# EAGLE design coderbot_v5.0.rev.2 (EAGLE 9.5.2)
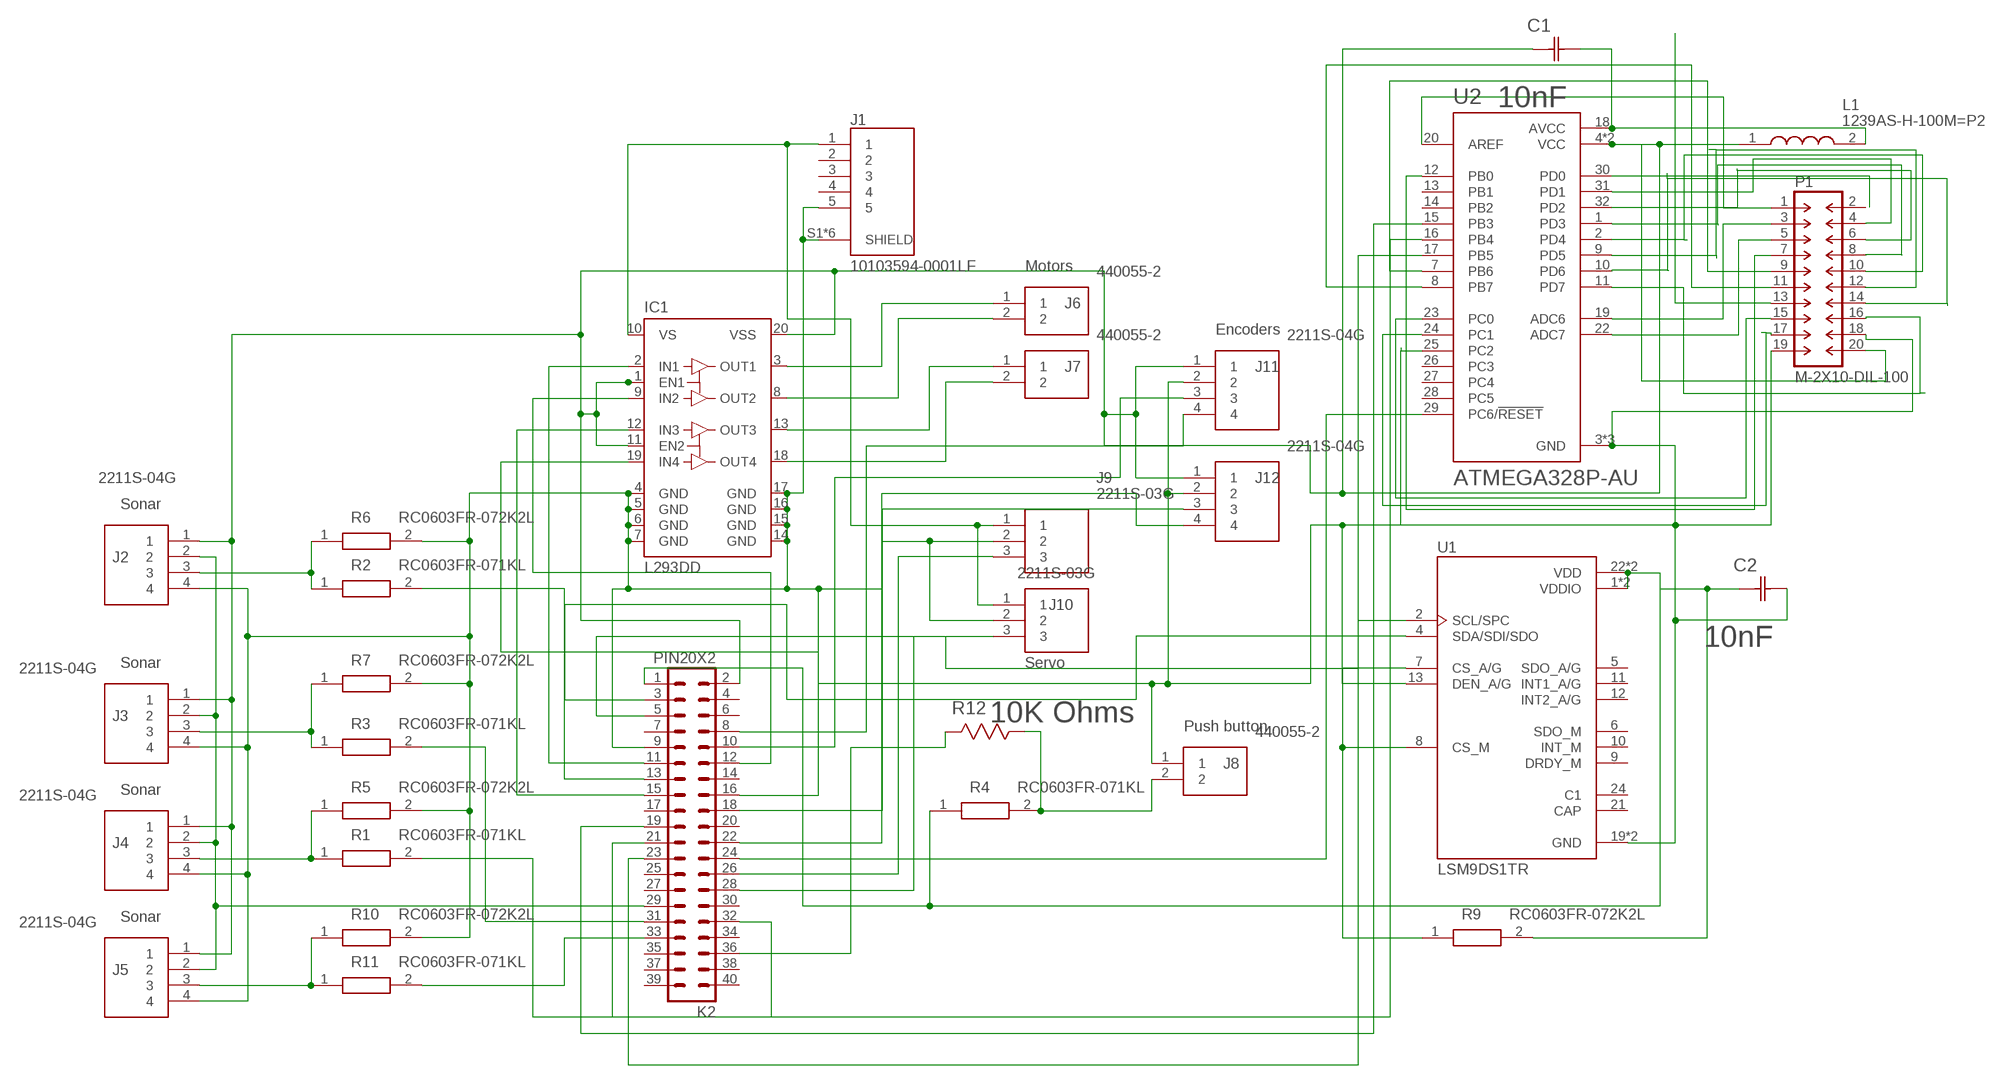
[diagram p0: schematic, sheet 1]

## Parts
C1  10nF  CC0402KRX7R7BB103  [CAPC1005X55N]
C2  10nF  CC0402KRX7R7BB103  [CAPC1005X55N]
IC1  L293DD  [SO20]
J1  10103594-0001LF  [FCI_10103594-0001LF]
J2  2211S-04G  [HDRV4W90P0X254_1X4_1016X254X87]
J3  2211S-04G  [HDRV4W90P0X254_1X4_1016X254X87]
J4  2211S-04G  [HDRV4W90P0X254_1X4_1016X254X87]
J5  2211S-04G  [HDRV4W90P0X254_1X4_1016X254X87]
J6  440055-2  [SHDR2W70P0X200_1X2_600X770X525]
J7  440055-2  [SHDR2W70P0X200_1X2_600X770X525]
J8  440055-2  [SHDR2W70P0X200_1X2_600X770X525]
J9  2211S-03G  [HDRV3W90P0X254_1X3_762X254X874]
J10  2211S-03G  [HDRV3W90P0X254_1X3_762X254X874]
J11  2211S-04G  [HDRV4W90P0X254_1X4_1016X254X87]
J12  2211S-04G  [HDRV4W90P0X254_1X4_1016X254X87]
K2  PIN20X2  [PIN_20X2]
L1  1239AS-H-100M=P2  [INDC2520X120N]
P1  M-2X10-DIL-100  [DIL-100-2X10]
R1  RC0603FR-071KL  [RESC1608X55N]
R2  RC0603FR-071KL  [RESC1608X55N]
R3  RC0603FR-071KL  [RESC1608X55N]
R4  RC0603FR-071KL  [RESC1608X55N]
R5  RC0603FR-072K2L  [RESC1608X55N]
R6  RC0603FR-072K2L  [RESC1608X55N]
R7  RC0603FR-072K2L  [RESC1608X55N]
R9  RC0603FR-072K2L  [RESC1608X55N]
R10  RC0603FR-072K2L  [RESC1608X55N]
R11  RC0603FR-071KL  [RESC1608X55N]
R12  10K Ohms  RC0603FR-0710KL  [RESC1608X60N]
U1  LSM9DS1TR  [PQFN43P300X350X102-24N]
U2  ATMEGA328P-AU  [QFP80P900X900X120-32N]

## Nets
GND: C2.2(C2) IC1.4(GND) IC1.5(GND) IC1.6(GND) IC1.7(GND) IC1.14(GND) IC1.15(GND) IC1.16(GND) IC1.17(GND) J1.5 J1.S1(SHIELD) J1.S2(SHIELD) J1.S3(SHIELD) J1.S4(SHIELD) J1.S5(SHIELD) J1.S6(SHIELD) J2.4 J3.4 J4.4 J5.4 J8.1 J9.2 J10.2 J11.2 J12.2 K2.9 P1.18 R5.2 R6.2 R7.2 R10.2 U1.13(DEN_A/G) U1.19(GND) U1.20(GND) U2.3(GND) U2.5(GND) U2.21(GND)
N$1 [vcc5m]: IC1.3(OUT1) J6.1
N$2 [vcc5m]: IC1.8(OUT2) J6.2
N$6 [vcc5m]: IC1.13(OUT3) J7.1
N$7 [vcc5m]: IC1.18(OUT4) J7.2
N$8: K2.13 R2.2
N$9: J2.2 J3.2 J4.2 J5.2 K2.29
N$10: J2.3 R2.1 R6.1
N$11 [vcc5]: C1.1(C1) IC1.1(EN1) IC1.11(EN2) IC1.20(VSS) J2.1 J3.1 J4.1 J5.1 J11.1 J12.1 K2.2 L1.1 P1.20 U2.4(VCC) U2.6(VCC)
N$12: J3.3 R3.1 R7.1
N$13: J8.2 R4.2 R12.1(R1)
N$14: J11.4 K2.8
N$15 [vcc5m]: IC1.10(VS) J1.1 J9.1 J10.1
N$16: J4.3 J5.3 R1.1 R5.1 R10.1 R11.1
N$17: J12.4 K2.22
N$18: J12.3 K2.18
N$19: K2.3 U1.4(SDA/SDI/SDO)
N$20: K2.5 U1.2(SCL/SPC)
N$21: IC1.2(IN1) K2.11
N$22: IC1.9(IN2) K2.12
N$23: IC1.12(IN3) K2.15
N$24: IC1.19(IN4) K2.16
N$25: K2.19 U2.15(PB3)
N$26: K2.31 R3.2
N$27: K2.32 R1.2
N$29: J11.3 K2.10
N$30: K2.21 U2.16(PB4)
N$31: K2.23 U2.17(PB5)
N$32: K2.24 U2.29(PC6/!RESET)
N$33 [vcc3]: C2.1(C1) K2.1 R4.1 R9.2 U1.1(VDDIO) U1.3(VDDIO) U1.22(VDD) U1.23(VDD)
N$34: R9.1 U1.7(CS_A/G) U1.8(CS_M)
N$35: C1.2(C2) L1.2 U2.18(AVCC)
N$36: J9.3 K2.26
N$37: K2.33 R11.2
N$38: J10.3 K2.28
N$39: P1.1 U2.20(AREF)
N$40: P1.3 U2.19(ADC6)
N$41: P1.5 U2.22(ADC7)
N$42: P1.7 U2.12(PB0)
N$43: P1.9 U2.7(PB6)
N$44: P1.11 U2.8(PB7)
N$45: P1.13
N$46: P1.15 U2.23(PC0)
N$47: P1.17 U2.24(PC1)
N$48: P1.19 U2.25(PC2)
N$49: U2.30(PD0)
N$50: P1.4 U2.31(PD1)
N$51: P1.6 U2.32(PD2)
N$52: P1.8 U2.1(PD3)
N$53: P1.10 U2.2(PD4)
N$54: P1.12 U2.9(PD5)
N$55: P1.14 U2.10(PD6)
N$56: P1.16 U2.11(PD7)
N$57: K2.36 R12.2(R2)
Unconnected: J1.2 J1.3 J1.4 K2.4 K2.6 K2.7 K2.14 K2.17 K2.20 K2.25 K2.27 K2.30 K2.34 K2.35 K2.37 K2.38 K2.39 K2.40 P1.2 U1.5(SDO_A/G) U1.6(SDO_M) U1.9(DRDY_M) U1.10(INT_M) U1.11(INT1_A/G) U1.12(INT2_A/G) U1.21(CAP) U1.24(C1) U2.13(PB1) U2.14(PB2) U2.26(PC3) U2.27(PC4) U2.28(PC5)

## Notes on the sheet
- Motors
- Encoders
- Sonar
- Sonar | Servo
- Push button
- Sonar
- Sonar

## Library data of the parts
C1 C2 = Yageo_By_element14_Batch_1:CC0402KRX7R7BB103: CAPACITOR, 0402; MPN: CC0402KRX7R7BB103; OC_FARNELL: 3019275; OC_NEWARK: 68R4639; SUPPLIER: Yageo; TOLERANCE: ±10%; VOLTAGERATING: 16V
IC1 = st-microelectronics:L293DD: PUSH-PULL FOUR CHANNEL DRIVER WITH DIODES Source: http://www.st.com/stonline/books/pdf/docs/1330.pdf; OC_FARNELL: unknown
J1 = 10103594-0001LF:10103594-0001LF: Micro Usb, 2.0 Type b, Receptacle, Smt; DESCRIPTION: Micro Usb, 2.0 Type b, Receptacle, Smt; DIGI-KEY_PART_NUMBER: 609-4050-1-ND; DIGI-KEY_PURCHASE_URL: https://www.digikey.it/product-detail/en/amphenol-icc-fci/10103594-0001LF/609-4050-1-ND/2350357?utm_source=snapeda&utm_medium=aggregator&utm_campaign=symbol; MF: Amphenol ICC; MP: 10103594-0001LF; PACKAGE: None
J2-J5 J11 J12 = 2211S-04G:2211S-04G: MULTICOMP - 2211S-04G - CONNECTOR, HEADER, THT, 2.54MM, 4WAY Source: Datasheet <http://www.farnell.com/datasheets/1518407.pdf>; DESCRIPTION: MULTICOMP - 2211S-04G - CONNECTOR, HEADER, THT, 2.54MM, 4WAY; HEIGHT: 8.74mm; MANUFACTURER_NAME: MULTICOMP; MANUFACTURER_PART_NUMBER: 2211S-04G
J6-J8 = 440055-2:440055-2: AMP - TE CONNECTIVITY - 440055-2 - CONNECTOR, HEADER, 2POS, 1ROW, 2MM Source: Datasheet <https://www.te.com/commerce/DocumentDelivery/DDEController?Action=showdoc&DocId=Customer Drawing440055B3pdfEnglishENG_CD_440055_B3.pdf440055-2>; DESCRIPTION: AMP - TE CONNECTIVITY - 440055-2 - CONNECTOR, HEADER, 2POS, 1ROW, 2MM; HEIGHT: 5.25mm; MANUFACTURER_NAME: TE Connectivity; MANUFACTURER_PART_NUMBER: 440055-2; MOUSER_PART_NUMBER: 571-440055-2; MOUSER_PRICE-STOCK: https://www.mouser.com/Search/Refine.aspx?Keyword=571-440055-2
J9 J10 = 2211S-03G:2211S-03G: MULTICOMP - 2211S-03G - HEADER, 1 ROW, VERT, 3WAY Source: Datasheet <http://es.farnell.com/multicomp/2211s-03g/macho-1-fila-vert-3-v-as/dp/1593412>; DESCRIPTION: MULTICOMP - 2211S-03G - HEADER, 1 ROW, VERT, 3WAY; HEIGHT: 8.74mm; MANUFACTURER_NAME: MULTICOMP; MANUFACTURER_PART_NUMBER: 2211S-03G
K2 = FLYFISH:PIN20X2
L1 = 1239AS-H-100M=P2:1239AS-H-100M=P2: Inductor Power Shielded Multi-Layer 10uH 20% 1MHz Metal 850mA 460mOhm DCR 1008 T/R Source: Datasheet <https://psearch.en.murata.com/inductor/product/1239AS-H-100M#.html>; DESCRIPTION: Inductor Power Shielded Multi-Layer 10uH 20% 1MHz Metal 850mA 460mOhm DCR 1008 T/R; HEIGHT: 1.2mm; MANUFACTURER_NAME: Murata Electronics; MANUFACTURER_PART_NUMBER: 1239AS-H-100M=P2; MOUSER_PART_NUMBER: 81-1239AS-H-100MP2; MOUSER_PRICE-STOCK: https://www.mouser.com/Search/Refine.aspx?Keyword=81-1239AS-H-100MP2; RS_PART_NUMBER: 1453485; RS_PRICE-STOCK: http://uk.rs-online.com/web/p/products/1453485
P1 = con-headers-jp:M-2X10-: MALE HEADER
R1-R4 R11 = RC0603FR-071KL:RC0603FR-071KL: GENERAL PURPOSE CHIP RESISTORS Source: Datasheet <http://www.yageo.com/documents/recent/PYu-RC_Group_51_RoHS_L___3.pdf>; DESCRIPTION: GENERAL PURPOSE CHIP RESISTORS; HEIGHT: 0.55mm; MANUFACTURER_NAME: YAGEO (PHYCOMP); MANUFACTURER_PART_NUMBER: RC0603FR-071KL; MOUSER_PART_NUMBER: 603-RC0603FR-071KL; MOUSER_PRICE-STOCK: https://www.mouser.com/Search/Refine.aspx?Keyword=603-RC0603FR-071KL; RS_PART_NUMBER: 5048928; RS_PRICE-STOCK: http://uk.rs-online.com/web/p/products/5048928
R5-R7 R9 R10 = RC0603FR-072K2L:RC0603FR-072K2L: YAGEO (PHYCOMP) - RC0603FR-072K2L. - RES, THICK FILM, 2K2, 1%, 0.1W, 0603 Source: Datasheet <http://www.yageo.com/documents/recent/PYu-RC0603_51_RoHS_L_v5.pdf>; DESCRIPTION: YAGEO (PHYCOMP) - RC0603FR-072K2L. - RES, THICK FILM, 2K2, 1%, 0.1W, 0603; HEIGHT: 0.55mm; MANUFACTURER_NAME: YAGEO (PHYCOMP); MANUFACTURER_PART_NUMBER: RC0603FR-072K2L; MOUSER_PART_NUMBER: 603-RC0603FR-072K2L; MOUSER_PRICE-STOCK: https://www.mouser.com/Search/Refine.aspx?Keyword=603-RC0603FR-072K2L; RS_PART_NUMBER: 5050319; RS_PRICE-STOCK: http://uk.rs-online.com/web/p/products/5050319
R12 = Yageo_By_element14_Batch_1:RC0603FR-0710KL: RESISTOR, 0603; MPN: RC0603FR-0710KL; OC_FARNELL: 1117235; OC_NEWARK: 98K7338; SUPPLIER: Yageo; TOLERANCE: ±1%; WATTAGE: 1/10 W
U1 = LSM9DS1TR:LSM9DS1TR: The LSM9DS1 is a system-in-package featuring a 3D digital linear acceleration sensor, a 3D digital angular rate sensor, and a 3D digital magnetic sensor.; AVAILABILITY: Unavailable; DESCRIPTION: LSM9DS1 Series ±2/±4/±8/±16 g 3D Digital Linear Acceleration Sensor - LGA-24; MF: STMicroelectronics; MP: LSM9DS1TR; PACKAGE: TFLGA-24 STMicroelectronics; PRICE: None
U2 = ATMEGA328P-AU:ATMEGA328P-AU: ATmega Series 20 MHz 32 KB Flash 2 KB SRAM 8-Bit Microcontroller - TQFP-32; AVAILABILITY: Unavailable; DESCRIPTION: Microcontroller Mcu, 8 Bit, Atmega, 20mhz, Tqfp-32; MF: Microchip; MP: ATMEGA328P-AU; PACKAGE: TQFP-32 Microchip; PRICE: None

## Net classes
1 gnd: width 0.508 mm, drill 0.508 mm
2 vcc5: width 0.508 mm, drill 0.508 mm
3 vcc3: width 0.051 mm, drill 0.051 mm
4 vcc5m: width 0.508 mm, drill 0.508 mm

## Board
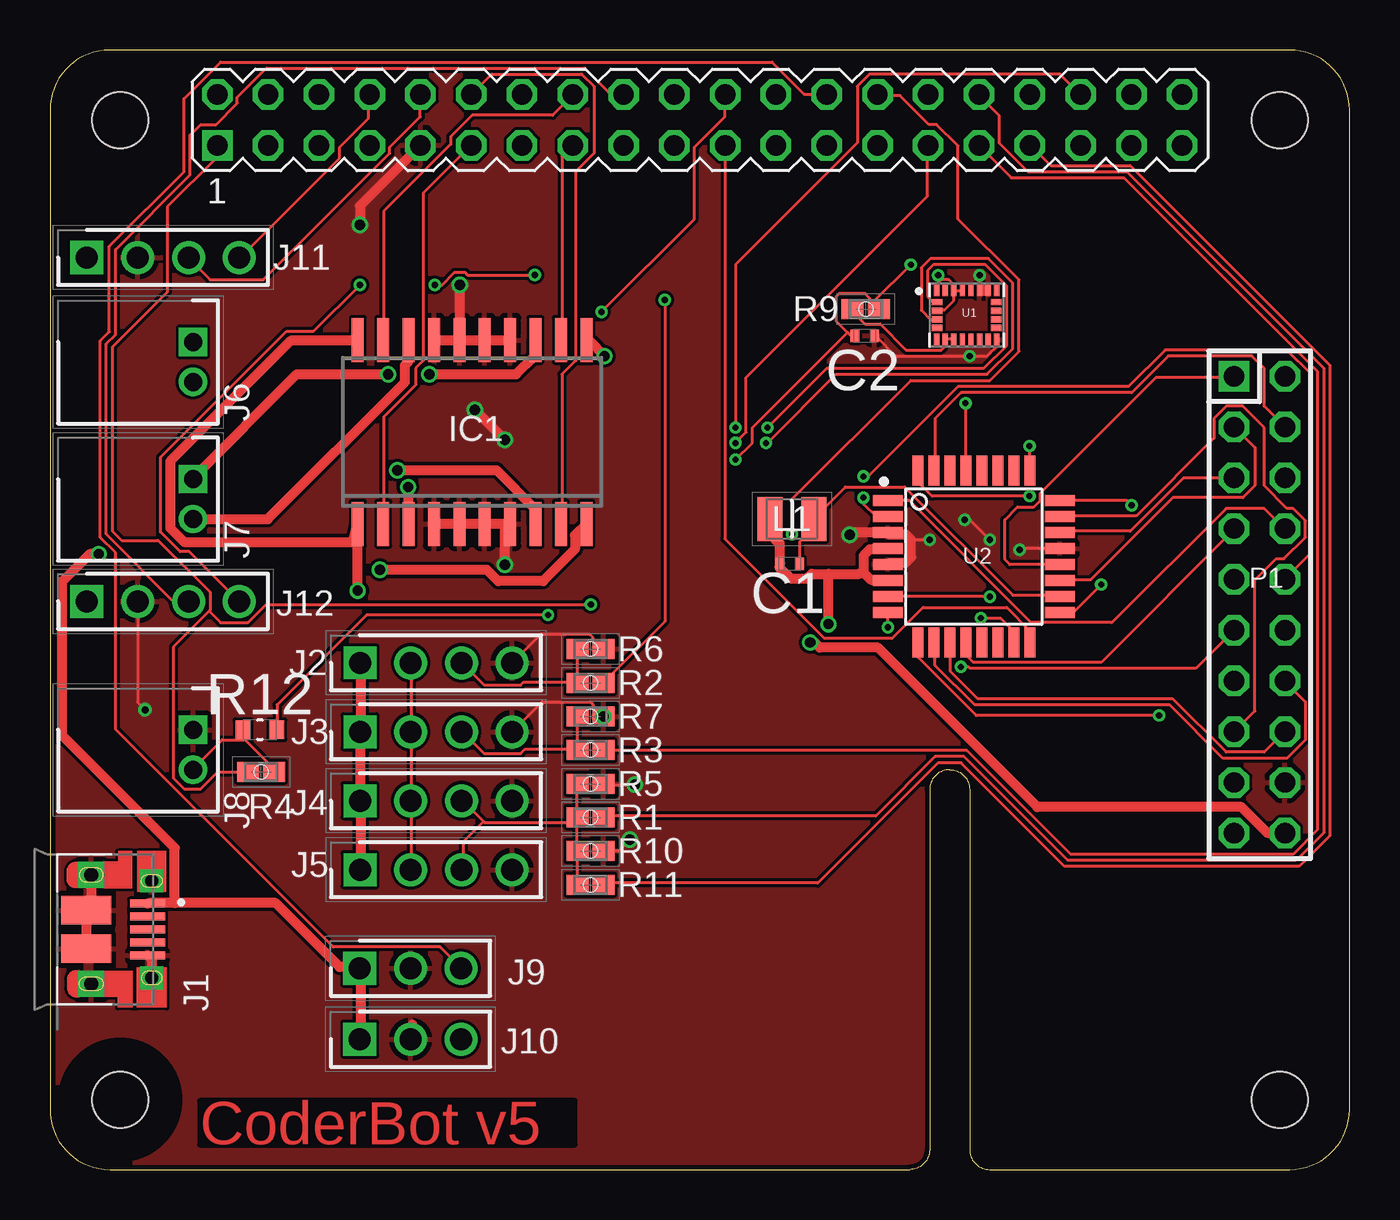
[diagram p1: board, top side]
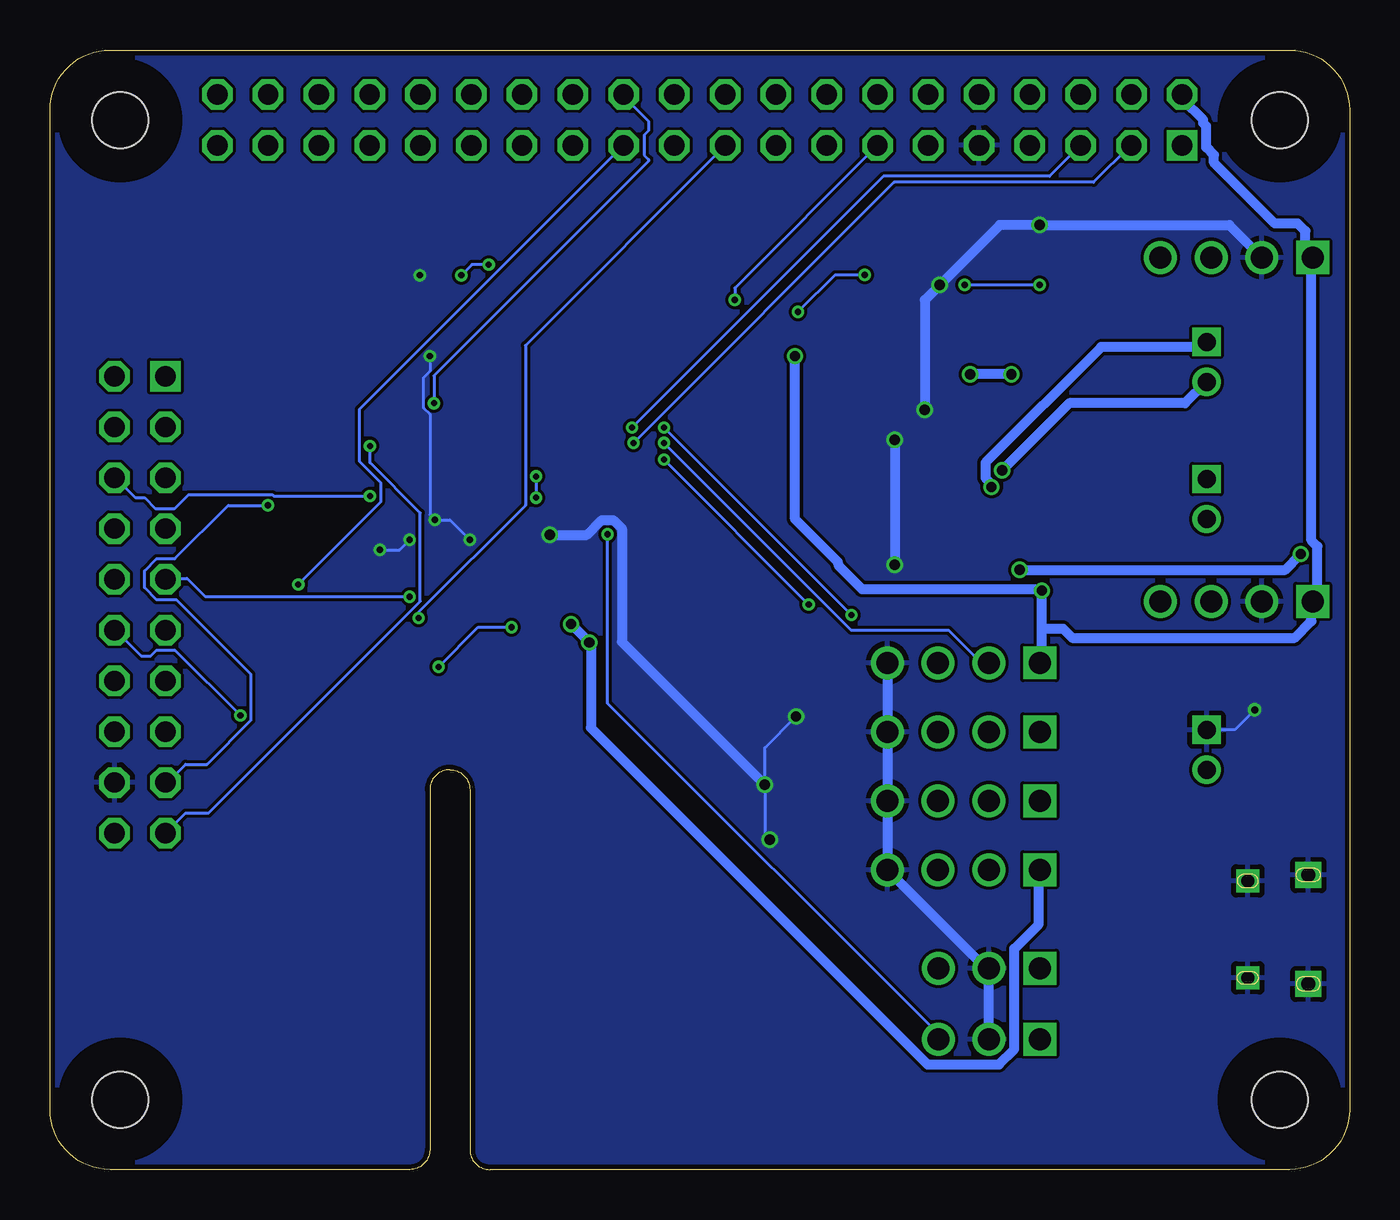
[diagram p2: board, bottom side, seen from below]

Size 65 x 56 mm. Coordinates in mm from the lower left corner, seen from the top.
Outline: 0,3 arc90 3,0 43,0 arc90 44,1 44,19 arc-90 45,20 arc-90 46,19 46,1 arc90 47,0 62,0 arc90 65,3 65,53 arc90 62,56 3,56 arc90 0,53 0,3
Copper layers (1*16): Top 0.035mm / dielectric 1.5mm / Bottom 0.035mm
Design rules "ITEADstudio_DRC": minimum track width 6mil, minimum drill 12mil, track to track 6mil, track to pad 6mil, pad to pad 6mil, via to via 6mil, smd to smd 0mil, copper to edge 10mil, drill to drill 10mil, minimum pad ring 10mil, minimum via ring 6mil, stop-mask expansion 2mil, vias tented up to drill 100mil, thermal gap 10mil
Holes 2.8 mm at 3.5,3.5 3.5,52.5 61.5,52.5 61.5,3.5
tRestrict: area 1.9,51 to 5,54; area 60,51 to 63,54; area 60,1.9 to 63,5; area 1.9,1.9 to 5,5
bRestrict: area 1.9,1.9 to 5,5; area 1.9,51 to 5,54; area 60,1.9 to 63,5; area 60,51 to 63,54

### Footprints (pad centres in the part's own frame; a part is rotated, then mirrored left to right if it is on the bottom)
CAPC1005X55N = smd 0.457 x 0.61: 1 -0.483,0; 2 0.483,0
SO20 = smd 0.6 x 2.2: 1 -5.715,-4.6; 2 -4.445,-4.6; 3 -3.175,-4.6; 4 -1.905,-4.6; 5 -0.635,-4.6; 6 0.635,-4.6; 7 1.905,-4.6; 8 3.175,-4.6; 9 4.445,-4.6; 10 5.715,-4.6; 11 5.715,4.6; 12 4.445,4.6; 13 3.175,4.6; 14 1.905,4.6; 15 0.635,4.6; 16 -0.635,4.6; 17 -1.905,4.6; 18 -3.175,4.6; 19 -4.445,4.6; 20 -5.715,4.6
FCI_10103594-0001LF = smd 0.4 x 1.75: 1 -1.3,2.825; 2 -0.65,2.825; 3 0,2.825; 4 0.65,2.825; 5 1.3,2.825 | smd 1.425 x 2.5: S1 -0.963,-0.25; S2 0.963,-0.25 | drill 0.65 pad 1.05 square: S3 -2.425,3.03; S4 2.425,3.03 | drill 0.7 pad 1.3 square: S5 -2.725,0; S6 2.725,0
HDRV4W90P0X254_1X4_1016X254X87 = drill 1.1 pad 1.65 square: 1 0,0 | drill 1.1 pad 1.65: 2 2.54,0; 3 5.08,0; 4 7.62,0
SHDR2W70P0X200_1X2_600X770X525 = drill 0.9 pad 1.35 square: 1 0,0 | drill 0.9 pad 1.35: 2 2,0
HDRV3W90P0X254_1X3_762X254X874 = drill 1.1 pad 1.65 square: 1 0,0 | drill 1.1 pad 1.65: 2 2.54,0; 3 5.08,0
PIN_20X2 = drill 1.016 square: 1 -24.13,-1.27 | drill 1.016 octagon: 2 -24.13,1.27; 3 -21.59,-1.27; 4 -21.59,1.27; 5 -19.05,-1.27; 6 -19.05,1.27; 7 -16.51,-1.27; 8 -16.51,1.27; 9 -13.97,-1.27; 10 -13.97,1.27; 11 -11.43,-1.27; 12 -11.43,1.27; 13 -8.89,-1.27; 14 -8.89,1.27; 15 -6.35,-1.27; 16 -6.35,1.27; 17 -3.81,-1.27; 18 -3.81,1.27; 19 -1.27,-1.27; 20 -1.27,1.27; 21 1.27,-1.27; 22 1.27,1.27; 23 3.81,-1.27; 24 3.81,1.27; 25 6.35,-1.27; 26 6.35,1.27; 27 8.89,-1.27; 28 8.89,1.27; 29 11.43,-1.27; 30 11.43,1.27; 31 13.97,-1.27; 32 13.97,1.27; 33 16.51,-1.27; 34 16.51,1.27; 35 19.05,-1.27; 36 19.05,1.27; 37 21.59,-1.27; 38 21.59,1.27; 39 24.13,-1.27; 40 24.13,1.27
INDC2520X120N = smd 1.25 x 2.2: 1 -1.1,0; 2 1.1,0
DIL-100-2X10 = drill 1.016 square: 1 -11.43,-1.27 | drill 1.016 octagon: 2 -11.43,1.27; 3 -8.89,-1.27; 4 -8.89,1.27; 5 -6.35,-1.27; 6 -6.35,1.27; 7 -3.81,-1.27; 8 -3.81,1.27; 9 -1.27,-1.27; 10 -1.27,1.27; 11 1.27,-1.27; 12 1.27,1.27; 13 3.81,-1.27; 14 3.81,1.27; 15 6.35,-1.27; 16 6.35,1.27; 17 8.89,-1.27; 18 8.89,1.27; 19 11.43,-1.27; 20 11.43,1.27
RESC1608X55N = smd 1.1 x 1: 1 -0.65,0; 2 0.65,0
RESC1608X60N = smd 0.762 x 0.94: 1 -0.838,0; 2 0.838,0
PQFN43P300X350X102-24N = smd 0.28 x 0.53: 1 -1.505,1.22; 6 -1.505,-1.22; 7 -1.075,-1.22; 8 -0.645,-1.22; 9 -0.215,-1.22; 10 0.215,-1.22; 11 0.645,-1.22; 12 1.075,-1.22; 13 1.505,-1.22; 18 1.505,1.22; 19 1.075,1.22; 20 0.645,1.22; 21 0.215,1.22; 22 -0.215,1.22; 23 -0.645,1.22; 24 -1.075,1.22 | smd 0.53 x 0.28: 2 -1.47,0.645; 3 -1.47,0.215; 4 -1.47,-0.215; 5 -1.47,-0.645; 14 1.47,-0.645; 15 1.47,-0.215; 16 1.47,0.215; 17 1.47,0.645
QFP80P900X900X120-32N = smd 1.5 x 0.55: 1 -4.3,2.8; 2 -4.3,2; 3 -4.3,1.2; 4 -4.3,0.4; 5 -4.3,-0.4; 6 -4.3,-1.2; 7 -4.3,-2; 8 -4.3,-2.8; 17 4.3,-2.8; 18 4.3,-2; 19 4.3,-1.2; 20 4.3,-0.4; 21 4.3,0.4; 22 4.3,1.2; 23 4.3,2; 24 4.3,2.8 | smd 0.55 x 1.5: 9 -2.8,-4.3; 10 -2,-4.3; 11 -1.2,-4.3; 12 -0.4,-4.3; 13 0.4,-4.3; 14 1.2,-4.3; 15 2,-4.3; 16 2.8,-4.3; 25 2.8,4.3; 26 2,4.3; 27 1.2,4.3; 28 0.4,4.3; 29 -0.4,4.3; 30 -1.2,4.3; 31 -2,4.3; 32 -2.8,4.3

### Placement (x,y rotation side)
C1  37,30.3 0 top
C2  40.75,41.7 0 top
IC1  21.11,36.9 0 top
J1  2.06,12.01 270 top
J2  15.5,25.35 0 top
J3  15.5,21.9 0 top
J4  15.5,18.45 0 top
J5  15.5,15 0 top
J6  7.15,41.4 270 top
J7  7.15,34.53 270 top
J8  7.15,22 270 top
J9  15.49,10.07 0 top
J10  15.49,6.52 0 top
J11  1.84,45.62 0 top
J12  1.84,28.42 0 top
K2  32.5,52.5 0 top
L1  37.1,32.55 0 top
P1  60.5,28.25 270 top
R1  27.03,17.62 0 top
R2  27.03,24.35 0 top
R3  27.03,20.98 0 top
R4  10.55,19.9 0 top
R5  27.03,19.3 0 top
R6  27.03,26.03 0 top
R7  27.03,22.66 0 top
R9  40.8,43.05 0 top
R10  27.03,15.93 0 top
R11  27.03,14.25 0 top
R12  10.5,22 0 top
U1  45.85,42.74 0 top
U2  46.21,30.66 0 top

### Tracks (layer width: path | path; a pad name or v marks a point on that pad's centre or on a via)
GND  (via drill 0.3, 0.35, 0.51)
  Top 0.152: U1.13 47.32,41.45 47.32,41.15 46.86,40.69 v46,40.69 42.29,40.69 41.3,41.68 C2.2 | R5.2 27.73,19.25 v29.25,19.25 | v29,16.5 28.43,15.93 R10.2 | R6.2 27.16,26.55 27.16,26.62 27.02,26.76 24.53,26.76 J2.4 | R7.2 27.16,23.19 27.16,23.26 27.02,23.39 24.61,23.39 J3.4 | U2.21 48.56,31.06 v48.5,31 | v47.02,31.5 46.02,32.5 v45.75,32.5 | v44,31.5 43.07,31.5 | U1.19 46.5,44.38 v46.5,44.73 | J12.2 4.38,23.36 v4.75,23
  Top 0.508: 46.71,43.97 46.71,43.96 | IC1.17 IC1.14 | IC1.16 20.5,41.52 v20.5,44.25 | v21.25,38 v22.75,36.5 | v22.75,30.25 22.75,32.03 IC1.7 IC1.4 | K2.9 15.5,48.2 v15.5,47.25 | 18.14,7.24 J10.2 | U2.5 42,30.35 42.8,30.35 43.07,30.62 43.07,31.5 42.83,31.74 42.03,31.74 U2.3 40.11,31.86 v40,31.75 | J1.5 5.09,10.51 J1.S4 | J1.S2 J1.S1 2.06,13.22 J1.S5
  Bottom 0.152: v29,16.5 29.25,16.75 v29.25,19.25 29.25,21.09 R7.2 | v48.5,31 47.52,31 v47.02,31.5 | v44,31.5 45,32.5 v45.75,32.5 46,32.75 46,37.78 46.33,38.11 46.33,39.6 46,39.93 v46,40.69 | v4.75,23 5.75,22 J8.1
  Bottom 0.508: v21.25,38 21.25,43.5 v20.5,44.25 17.5,47.25 v15.5,47.25 6.01,47.25 J11.2 | v22.75,36.5 v22.75,30.25 | J2.4 J3.4 J5.4 18.19,10.07 | 18.19,10.07 J9.2 | v29.25,19.25 36.4,26.4 36.4,32.07 36.81,32.49 37.4,32.49 38.14,31.75 v40,31.75 | J10.2 18.03,9.91 18.19,10.07
  other vias: 27.68,22.66
  pour Bottom: 0,0 43,0 arc90 44,1 44,19 arc-90 45,20 arc-90 46,19 46,1 arc90 47,0 62,0 arc90 65,3 65,53 arc90 62,56 0,56
  pour Top: 0,0 43,0 arc90 44,1 44,19 arc-90 45,20 arc-90 46,19 46,1 arc90 47,0 62,0 arc90 65,3 65,53 arc90 62,56 0,56
N$1  (via drill 0.51)
  Top 0.508: v17.91,34.14 17.91,32.31 IC1.3
  Bottom 0.508: v17.91,34.14 17.91,34.29 18.21,34.59 18.21,35.36 12.42,41.15 7.39,41.15 7.16,41.38 J6.1
N$2  (via drill 0.51)
  Top 0.508: v17.37,34.98 22.33,34.98 24.23,33.07 24.23,32.31 IC1.8
  Bottom 0.508: v17.37,34.98 14.02,38.33 8.23,38.33 7.16,39.4 J6.2
N$6  (via drill 0.51)
  Top 0.508: v18.97,39.78 23.32,39.78 24.23,40.69 24.23,41.45 IC1.13 | v16.92,39.78 12.34,39.78 7.16,34.59 J7.1
  Bottom 0.508: v16.92,39.78 v18.97,39.78
N$7
  Top 0.508: IC1.18 17.91,41.45 17.91,40.39 17.75,40.23 17.75,39.4 10.9,32.54 7.16,32.54 J7.2
N$8  (via drill 0.3)
  Top 0.152: 27.74,24.69 27.74,24.38 R2.2 | R2.2 | 23.62,51.21 K2.13 | v30.75,43.5 30.75,27.41 R2.2
  Bottom 0.152: K2.13 30.75,44.09 v30.75,43.5
N$9  (via drill 0.3)
  Top 0.152: J5.2 18.06,15.01 18.06,18.44 J4.2 18.06,18.52 18.06,21.87 J3.2 18.06,21.95 18.06,25.3 J2.2 | v34.29,36.35 34.82,36.88 34.82,39.62 43.89,48.69 43.89,51.21 K2.29
  Bottom 0.152: v34.29,36.35 24.92,26.98 20.04,26.98 18.44,25.38 18.06,25.38 J2.2
N$10
  Top 0.152: R6.1 26.36,25.98 26.36,24.38 R2.1 26.29,24.38 23.7,24.38 23.55,24.23 21.72,24.23 20.65,25.3 J2.3
N$11  (via drill 0.51)
  Top 0.508: J5.1 15.54,15.01 15.54,18.44 J4.1 15.54,18.67 15.54,21.87 J3.1 15.54,22.1 15.54,25.3 J2.1 | 15.39,32.23 IC1.1 | 40.69,29.87 41.07,29.49 41.91,29.49 U2.6 | 40.69,29.87 40.69,30.71 41,31.01 41.91,31.01 U2.4 | L1.1 36.04,32.54 36.04,31.77 36.5,31.32 36.5,30.33 C1.1 36.5,30.1 37.03,29.57 37.87,29.57 38.1,29.79 38.94,29.79 | 38.94,29.79 40.46,29.79 40.69,29.87 | 26.82,41.45 IC1.11 27.05,41.38 v27.74,40.69 | P1.20 61.72,16.84 60.88,16.84 59.59,18.14 49.38,18.14 41.4,26.11 38.51,26.11 38.26,26.36 v38.02,26.36 | v38.94,27.28 38.94,29.79 | v15.39,28.96 15.39,32 IC1.1 | IC1.1 15.16,31.39 6.71,31.39 6.02,32.08 6.02,35.43 12.04,41.45 15.39,41.45 IC1.20
  Bottom 0.508: K2.2 8.31,53.72 8.31,53.49 7.32,52.5 7.32,52.35 7.16,52.2 7.16,51.13 6.78,50.75 6.78,50.37 3.73,47.32 2.59,47.32 2.21,46.94 2.21,45.95 1.91,45.64 J11.1 1.91,45.41 1.91,31.47 1.6,31.17 1.6,28.8 1.75,28.65 J12.1 1.91,28.35 1.91,27.43 2.74,26.59 13.87,26.59 14.33,27.05 15.39,27.05 | 15.39,27.05 15.39,25.45 15.47,25.38 J2.1 | 15.39,27.05 v15.39,28.96 15.62,29.03 24.38,29.03 25.53,30.18 25.6,30.4 27.74,32.54 v27.74,40.69 | v38.94,27.28 v38.02,26.36 37.95,26.14 37.95,22.1 21.11,5.26 17.53,5.26 16.76,6.02 16.76,11.05 15.54,12.27 15.54,14.94 J5.1
N$12
  Top 0.152: R7.1 26.36,22.63 26.36,21.03 R3.1 26.29,21.03 23.77,21.03 23.55,20.8 21.72,20.8 20.65,21.87 J3.3
N$13
  Top 0.152: 9.72,21.53 11.12,20.12 11.12,19.96 R4.2 | 9.72,21.53 9.68,21.57 9.68,21.95 R12.1 | 9.72,21.53 9.68,21.49 8.61,21.49 7.16,20.04 J8.2
N$14
  Top 0.152: K2.8 15.93,53.72 15.93,52.58 14.48,51.13 14.48,50.6 9.53,45.64 J11.4
N$15  (via drill 0.51)
  Top 0.508: 6.25,13.34 11.28,13.34 14.48,10.13 15.47,10.13 J9.1 15.54,9.83 15.54,6.55 J10.1 | 6.25,13.34 4.95,13.34 J1.1 | 6.25,13.34 6.25,16.08 0.61,21.72 0.61,29.41 1.98,30.79 v2.44,30.79 | IC1.10 26.26,31.74 26.26,31.03 24.67,29.44 22.41,29.44 21.85,30 v16.5,30
  Bottom 0.508: v16.5,30 3.22,30 v2.44,30.79
N$16
  Top 0.152: R11.1 26.36,14.33 26.36,15.93 R10.1 26.36,16 26.36,17.37 | 26.36,17.37 26.36,17.6 R1.1 | R5.1 26.36,19.28 26.36,17.68 R1.1 | 26.36,17.37 21.72,17.37 21.68,17.41 | 21.68,17.41 20.65,18.44 J4.3 | 26.36,17.37 R1.1 | 21.68,17.41 20.65,16.38 20.65,15.01 J5.3
N$17  (via drill 0.3)
  Top 0.152: v27.58,42.9 32.23,47.55 32.23,51.13 33.76,52.65 33.76,53.72 K2.22 | v15.5,44.25 13.19,41.94 11.84,41.94 5.54,35.63 5.54,31.88 6.51,30.91 6.97,30.91 J12.4 | v19.25,44.25 19.6,44.25 20.24,44.88 20.76,44.88 20.9,44.75 v24.25,44.75
  Bottom 0.152: v15.5,44.25 v19.25,44.25 | v24.25,44.75 25.73,44.75 v27.58,42.9
N$18
  Top 0.152: K2.18 28.65,53.8 28.04,53.8 26.75,55.09 10.82,55.09 9.37,53.65 9.37,53.34 8.31,52.27 7.54,52.27 7.01,51.74 7.01,49.76 3.28,46.02 3.28,41.76 2.82,41.3 2.82,31.77 6.17,28.42 6.86,28.42 J12.3
N$19  (via drill 0.3)
  Top 0.152: v35.81,36.35 35.89,36.35 39.32,39.78 46.86,39.78 48.16,41.07 48.16,44.35 46.94,45.57 44.04,45.57 43.59,45.11 43.59,42.98 44.04,42.52 44.35,42.52 U1.4
  Bottom 0.152: v35.81,36.35 22.78,49.38 12.8,49.38 10.97,51.21 K2.3
N$20  (via drill 0.3)
  Top 0.152: v35.89,37.11 38.86,40.08 46.71,40.08 47.85,41.22 47.85,44.2 46.79,45.26 44.2,45.26 43.89,44.96 43.89,43.66 44.12,43.43 44.35,43.43 U1.2
  Bottom 0.152: v35.89,37.11 23.32,49.68 15.01,49.68 13.49,51.21 K2.5
N$21
  Top 0.152: IC1.2 16.69,32.31 16.69,37.64 18.29,39.24 18.29,40.08 18.67,40.46 18.67,48.84 21.03,51.21 K2.11
N$22
  Top 0.152: IC1.9 25.6,32.31 25.6,39.78 26.29,40.46 26.29,49.91 27.2,50.83 27.2,54.18 26.59,54.79 22.1,54.79 21.11,53.8 K2.12
N$23
  Top 0.152: IC1.12 25.6,41.53 25.6,50.67 26.14,51.21 K2.15
N$24
  Top 0.152: IC1.19 16.69,41.53 16.69,47.93 20.04,51.28 20.04,51.66 21.11,52.73 25.15,52.73 26.14,53.72 K2.16
N$25  (via drill 0.3)
  Top 0.152: v46.56,27.58 47.55,27.58 48.16,26.98 48.16,26.36 U2.15
  Bottom 0.152: v46.56,27.58 46.56,27.89 41.22,33.22 41.22,41.22 31.24,51.21 K2.19
N$26
  Top 0.152: R3.2 27.74,20.95 45.87,20.95 51.05,15.77 62.18,15.77 63.4,16.99 63.4,39.93 53.72,49.61 48.08,49.61 46.48,51.21 K2.31
N$27
  Top 0.152: R1.2 27.74,17.68 41.3,17.68 44.27,20.65 45.72,20.65 50.9,15.47 62.33,15.47 63.7,16.84 63.7,40.08 53.87,49.91 48.92,49.91 47.47,51.36 47.47,52.73 46.48,53.72 K2.32
N$29
  Top 0.152: K2.10 18.52,53.72 18.52,52.65 16.99,51.13 16.99,50.83 10.67,44.5 8,44.5 6.93,45.57 J11.3
N$30
  Top 0.152: U2.16 49,26.36 49,26.98 47.85,28.12 43.66,28.12 42.14,26.59 38.71,26.59 33.76,31.55 33.76,51.21 K2.21
N$31  (via drill 0.3)
  Top 0.152: v52.58,29.26 51.21,27.89 50.52,27.89 U2.17
  Bottom 0.152: v52.58,29.26 48.46,33.38 48.46,34.37 49.53,35.43 49.53,38.02 36.35,51.21 K2.23
N$32  (via drill 0.3)
  Top 0.152: v45.8,38.33 45.8,34.98 U2.29
  Bottom 0.152: v45.8,38.33 45.8,39.7 35.05,50.44 35.05,50.52 35.28,50.75 35.28,51.74 35.05,51.97 35.05,52.43 36.35,53.72 K2.24
N$33  (via drill 0.3)
  Top 0.152: U1.3 44.42,42.98 44.73,42.98 45.19,43.43 45.19,43.89 U1.23 | 44.54,44.46 44.58,44.5 44.96,44.5 45.19,44.27 45.19,43.97 U1.23 | 44.54,44.46 44.35,44.27 U1.1 | U1.22 45.57,43.97 45.26,43.97 U1.23 | 39.89,41.87 39.32,42.44 39.32,43.66 39.47,43.81 40.77,43.81 41.38,43.2 41.38,43.05 R9.2 41.22,43.43 v43.05,45.26 | 39.89,41.87 40.01,41.76 40.23,41.76 C2.1 | v44.42,44.73 44.5,44.65 44.5,44.5 44.54,44.46 | 7.96,27.93 8,27.96 8,28.88 5.41,31.47 3.58,31.47 3.12,31.93 3.12,41.15 5.87,43.89 5.87,48.16 8.31,50.6 8.31,51.21 K2.1 | 7.96,27.93 6.17,26.14 6.17,19.58 6.71,19.05 7.54,19.05 8.38,19.89 9.83,19.89 R4.1 | 39.89,41.87 35.13,37.11 35.13,36.35 v34.29,35.51 | v27.05,28.27 10.82,28.27 9.91,27.36 8.53,27.36 7.96,27.93
  Bottom 0.152: v44.42,44.73 43.89,45.26 v43.05,45.26 | v27.05,28.27 v34.29,35.51
N$34
  Top 0.152: U1.8 45.19,41.53 44.81,41.53 U1.7 44.73,41.45 44.73,41.15 44.58,41 42.82,41 41.53,42.29 40.77,42.29 40.08,42.98 R9.1
N$35
  Top 0.152: C1.2 37.49,30.33 37.49,31.39 38.18,32.08 38.18,32.54 L1.2 38.25,32.61 39.78,34.14 42.75,34.14 48.16,28.73 50.44,28.73 U2.18
N$36
  Top 0.152: K2.26 38.79,53.8 37.72,53.8 36.12,55.4 8.53,55.4 6.71,53.57 6.71,49.91 2.97,46.18 2.97,41.91 2.52,41.45 2.52,31.62 3.28,30.86 3.28,22.02 14.17,11.12 19.51,11.12 20.5,10.13 J9.3
N$37
  Top 0.152: R11.2 27.74,14.33 38.41,14.33 44.42,20.34 45.57,20.34 50.75,15.16 62.48,15.16 64.01,16.69 64.01,40.23 54.03,50.22 50.06,50.22 49.07,51.21 K2.33
N$38  (via drill 0.3)
  Top 0.152: v37.11,31.77 37.11,33.53 43.05,39.47 47.02,39.47 48.46,40.92 48.46,44.5 45.41,47.55 45.41,51.21 44.35,52.27 43.97,52.27 42.52,53.72 41.45,53.72 K2.28
  Bottom 0.152: v37.11,31.77 37.11,23.32 20.57,6.78 20.57,6.55 J10.3
N$39
  Top 0.152: 49.84,30.33 50.44,30.33 U2.20 48.01,30.26 | P1.1 59.21,39.62 55.32,39.62 49.53,33.83 49.53,33.46 49.22,33.15 48.4,33.15 47.75,32.5 47.75,30.52 48.01,30.26 | 48.01,30.26 48,30.25
N$40
  Top 0.152: U2.19 50.52,29.49 52.05,29.49 56.16,33.6 59.66,33.6 60.27,34.21 60.27,36.12 59.28,37.11 P1.3
N$41
  Top 0.152: U2.22 50.52,31.93 54.03,31.93 56.69,34.59 59.21,34.59 P1.5
N$42
  Top 0.152: U2.12 45.87,26.29 45.87,25.68 46.18,25.38 52.58,25.38 59.21,32 P1.7
N$43  (via drill 0.3)
  Top 0.152: v47.02,28.65 U2.7
  Bottom 0.152: v47.02,28.65 57.23,28.65 58.14,29.57 59.21,29.57 P1.9
N$44  (via drill 0.3)
  Top 0.152: v41.91,27.13 U2.8 | v45.57,25.15 45.95,25.15 46.02,25.07 57.3,25.07 59.21,26.98 P1.11
  Bottom 0.152: v41.91,27.13 43.59,27.13 v45.57,25.15
N$46
  Top 0.152: U2.23 50.52,32.69 54.33,32.69 58.22,36.58 58.22,37.57 58.83,38.18 59.66,38.18 60.73,37.11 60.73,34.21 61.87,33.07 62.18,33.07 62.79,32.46 62.79,31.62 61.72,30.56 61.34,30.56 60.27,29.49 60.27,22.94 59.28,21.95 P1.15
N$47  (via drill 0.3)
  Top 0.152: v54.1,33.22 53.87,33.45 50.52,33.45 U2.24
  Bottom 0.152: v54.1,33.22 56.08,33.22 58.75,30.56 59.66,30.56 60.27,29.95 60.27,29.11 59.66,28.5 58.67,28.5 54.94,24.77 54.94,22.48 57.15,20.27 58.22,20.27 59.05,19.43 59.21,19.43 P1.17
N$48  (via drill 0.3)
  Top 0.152: v49,36.2 49,34.98 U2.25
  Bottom 0.152: v49,36.2 49,35.36 46.48,32.84 46.48,28.42 57.07,17.83 58.22,17.83 59.21,16.84 P1.19
N$50
  Top 0.152: U2.31 44.27,34.98 44.27,37.57 45.57,38.86 54.1,38.86 55.93,40.69 60.12,40.69 60.73,40.08 60.73,38.18 61.72,37.19 P1.4
N$51  (via drill 0.3)
  Top 0.152: v49,33.68 44.12,33.68 43.43,34.37 43.43,34.9 U2.32
  Bottom 0.152: v49,33.68 53.8,33.68 53.87,33.76 58.06,33.76 58.75,33.07 59.74,33.07 60.27,33.6 60.73,33.6 61.72,34.59 P1.6
N$52
  Top 0.152: U2.1 42.98,33.45 49.07,27.36 53.11,27.36 58.83,33.07 60.73,33.07 61.72,32.08 P1.8
N$53  (via drill 0.3)
  Top 0.152: v40.69,33.6 40.69,33.3 41.3,32.69 41.91,32.69 U2.2 | v40.69,34.67 40.92,34.67 45.41,39.17 53.95,39.17 55.78,41 61.87,41 63.09,39.78 63.09,30.86 61.8,29.57 P1.10
  Bottom 0.152: v40.69,34.67 v40.69,33.6
N$54  (via drill 0.3)
  Top 0.152: v55.47,22.71 46.33,22.71 43.43,25.6 43.43,26.29 U2.9
  Bottom 0.152: v55.47,22.71 58.75,25.98 59.66,25.98 59.97,25.68 60.43,25.68 61.72,26.98 P1.12
N$55
  Top 0.152: U2.10 44.27,26.29 44.27,25.22 46.25,23.24 56.01,23.24 58.67,20.57 61.87,20.57 62.79,21.49 62.79,23.39 61.8,24.38 P1.14
N$56
  Top 0.152: U2.11 45.03,26.29 45.03,24.92 46.41,23.55 56.16,23.55 58.83,20.88 60.73,20.88 61.72,21.87 P1.16
N$57  (via drill 0.3)
  Top 0.152: v24.92,27.74 15.85,27.74 11.35,23.24 11.35,22.02 R12.2 | v34.29,37.11 34.29,45.26 40.39,51.36 40.39,54.18 41,54.79 50.52,54.79 51.51,53.8 K2.36
  Bottom 0.152: v34.29,37.11 v24.92,27.74

### Text on the board
Top: CoderBot v5